# EAGLE design 50 pin 0.5mm FPC (EAGLE 6.4)
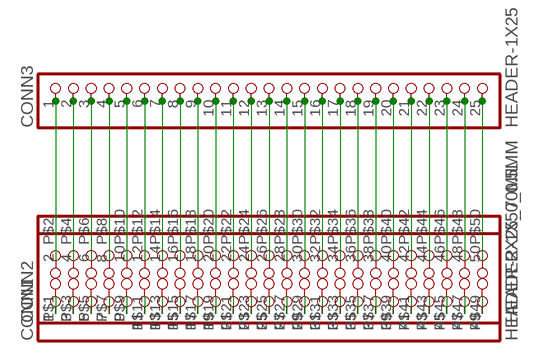
[diagram p0: schematic, sheet 1]

## Parts
CONN1  HEADER-2X25_70MIL  [2X25]
CONN2  HEADER-1X50_0.5MM  [FPC_GENERIC_0.5MM_50PIN]
CONN3  HEADER-1X25  [1X25_ROUND_70MIL]

## Nets
N$1: CONN1.1 CONN2.P$1
N$2: CONN1.2 CONN2.P$2 CONN3.1
N$3: CONN1.3 CONN2.P$3
N$4: CONN1.4 CONN2.P$4 CONN3.2
N$5: CONN1.5 CONN2.P$5
N$6: CONN1.6 CONN2.P$6 CONN3.3
N$7: CONN1.7 CONN2.P$7
N$8: CONN1.8 CONN2.P$8 CONN3.4
N$9: CONN1.9 CONN2.P$9
N$10: CONN1.10 CONN2.P$10 CONN3.5
N$11: CONN1.11 CONN2.P$11
N$12: CONN1.12 CONN2.P$12 CONN3.6
N$13: CONN1.13 CONN2.P$13
N$14: CONN1.14 CONN2.P$14 CONN3.7
N$15: CONN1.15 CONN2.P$15
N$16: CONN1.16 CONN2.P$16 CONN3.8
N$17: CONN1.17 CONN2.P$17
N$18: CONN1.18 CONN2.P$18 CONN3.9
N$19: CONN1.19 CONN2.P$19
N$20: CONN1.20 CONN2.P$20 CONN3.10
N$21: CONN1.21 CONN2.P$21
N$22: CONN1.22 CONN2.P$22 CONN3.11
N$23: CONN1.23 CONN2.P$23
N$24: CONN1.24 CONN2.P$24 CONN3.12
N$25: CONN1.25 CONN2.P$25
N$26: CONN1.26 CONN2.P$26 CONN3.13
N$27: CONN1.27 CONN2.P$27
N$28: CONN1.28 CONN2.P$28 CONN3.14
N$29: CONN1.29 CONN2.P$29
N$30: CONN1.30 CONN2.P$30 CONN3.15
N$31: CONN1.31 CONN2.P$31
N$32: CONN1.32 CONN2.P$32 CONN3.16
N$33: CONN1.33 CONN2.P$33
N$34: CONN1.34 CONN2.P$34 CONN3.17
N$35: CONN1.35 CONN2.P$35
N$36: CONN1.36 CONN2.P$36 CONN3.18
N$37: CONN1.37 CONN2.P$37
N$38: CONN1.38 CONN2.P$38 CONN3.19
N$39: CONN1.39 CONN2.P$39
N$40: CONN1.40 CONN2.P$40 CONN3.20
N$41: CONN1.41 CONN2.P$41
N$42: CONN1.42 CONN2.P$42 CONN3.21
N$43: CONN1.43 CONN2.P$43
N$44: CONN1.44 CONN2.P$44 CONN3.22
N$45: CONN1.45 CONN2.P$45
N$46: CONN1.46 CONN2.P$46 CONN3.23
N$47: CONN1.47 CONN2.P$47
N$48: CONN1.48 CONN2.P$48 CONN3.24
N$49: CONN1.49 CONN2.P$49
N$50: CONN1.50 CONN2.P$50 CONN3.25

## Library data of the parts
CONN1 = microbuilder:HEADER-2X25
CONN2 = microbuilder:HEADER-1X50
CONN3 = microbuilder:HEADER-1X25

## Board
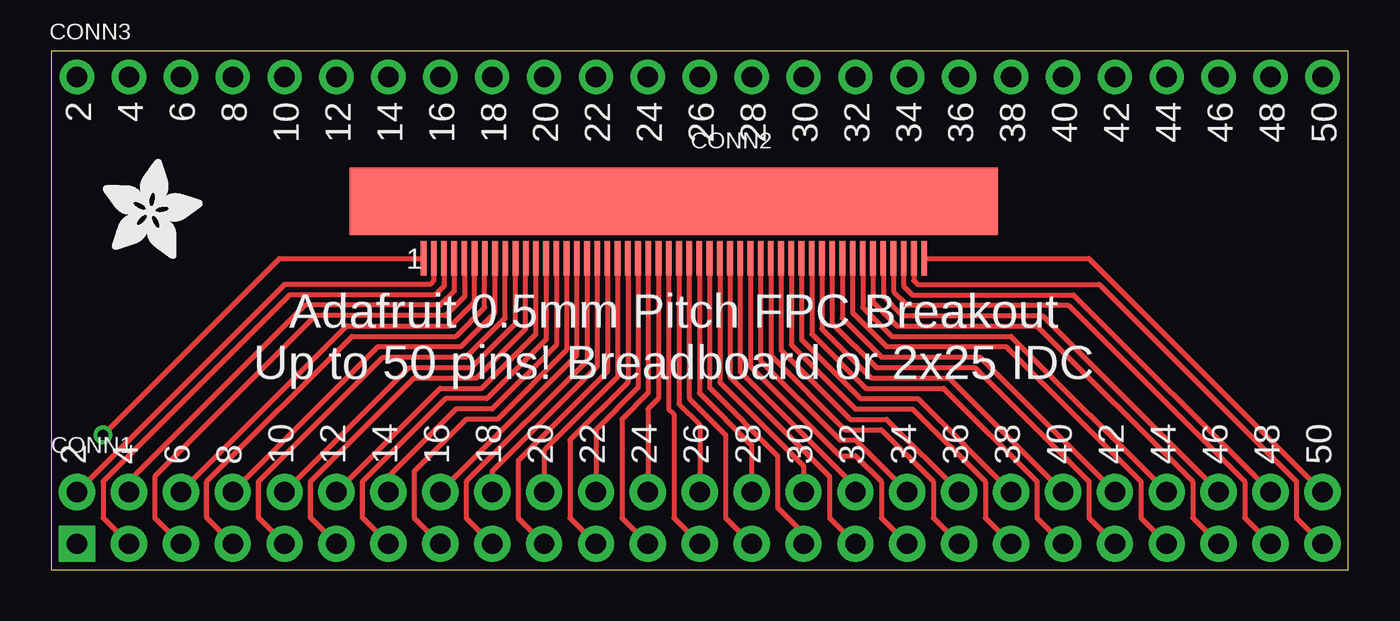
[diagram p1: board, top side]
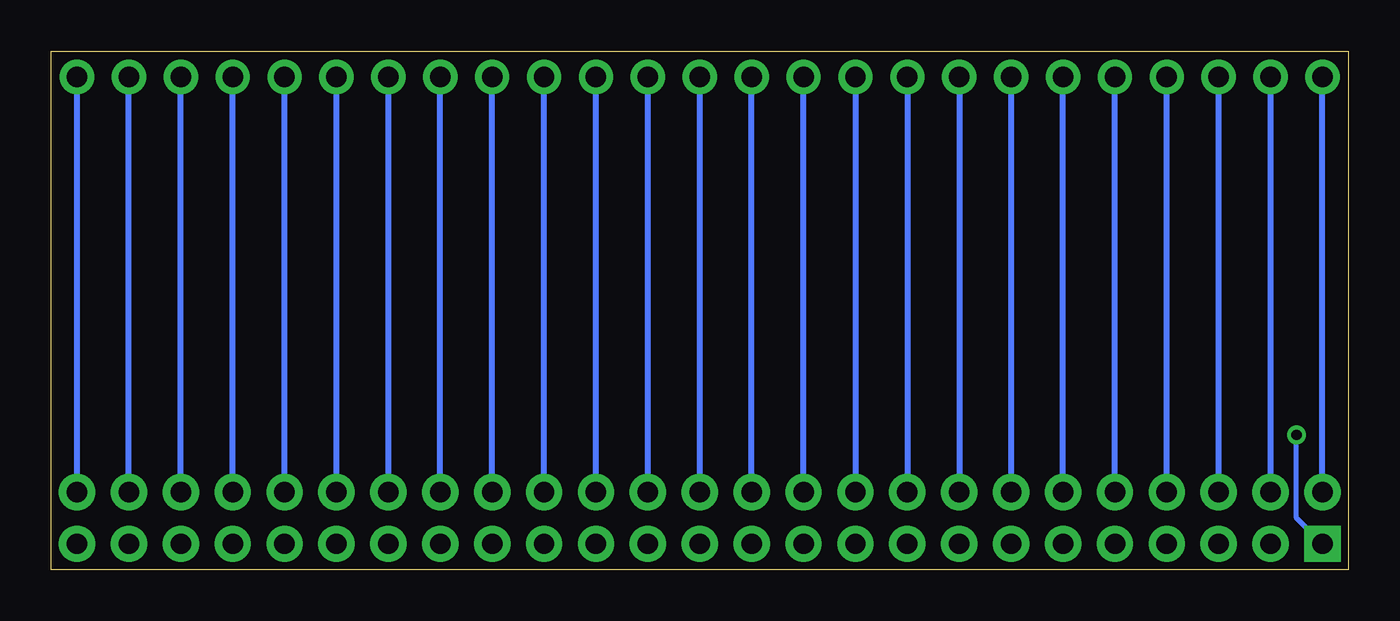
[diagram p2: board, bottom side, seen from below]

Size 63.5 x 25.4 mm. Coordinates in mm from the lower left corner, seen from the top.
Outline: 0,25.4 0,0 63.5,0 63.5,25.4 0,25.4
Copper layers (1*16): Top 0.035mm / dielectric 1.5mm / Bottom 0.035mm
Design rules "default": minimum track width 10mil, minimum drill 24mil, track to track 8mil, track to pad 8mil, pad to pad 8mil, via to via 8mil, smd to smd 8mil, copper to edge 40mil, drill to drill 8mil, minimum pad ring 10mil, minimum via ring 8mil, stop-mask expansion 4mil, vias tented up to drill 0mil, thermal gap 10mil

### Footprints (pad centres in the part's own frame; a part is rotated, then mirrored left to right if it is on the bottom)
2X25 = drill 1 pad 1.778 square: 1 -30.48,-1.27 | drill 1 pad 1.778: 2 -30.48,1.27; 3 -27.94,-1.27; 4 -27.94,1.27; 5 -25.4,-1.27; 6 -25.4,1.27; 7 -22.86,-1.27; 8 -22.86,1.27; 9 -20.32,-1.27; 10 -20.32,1.27; 11 -17.78,-1.27; 12 -17.78,1.27; 13 -15.24,-1.27; 14 -15.24,1.27; 15 -12.7,-1.27; 16 -12.7,1.27; 17 -10.16,-1.27; 18 -10.16,1.27; 19 -7.62,-1.27; 20 -7.62,1.27; 21 -5.08,-1.27; 22 -5.08,1.27; 23 -2.54,-1.27; 24 -2.54,1.27; 25 0,-1.27; 26 0,1.27; 27 2.54,-1.27; 28 2.54,1.27; 29 5.08,-1.27; 30 5.08,1.27; 31 7.62,-1.27; 32 7.62,1.27; 33 10.16,-1.27; 34 10.16,1.27; 35 12.7,-1.27; 36 12.7,1.27; 37 15.24,-1.27; 38 15.24,1.27; 39 17.78,-1.27; 40 17.78,1.27; 41 20.32,-1.27; 42 20.32,1.27; 43 22.86,-1.27; 44 22.86,1.27; 45 25.4,-1.27; 46 25.4,1.27; 47 27.94,-1.27; 48 27.94,1.27; 49 30.48,-1.27; 50 30.48,1.27
FPC_GENERIC_0.5MM_50PIN = smd 0.28 x 1.7: P$1 12.25,1.01; P$2 11.75,1.01; P$3 11.25,1.01; P$4 10.75,1.01; P$5 10.25,1.01; P$6 9.75,1.01; P$7 9.25,1.01; P$8 8.75,1.01; P$9 8.25,1.01; P$10 7.75,1.01; P$11 7.25,1.01; P$12 6.75,1.01; P$13 6.25,1.01; P$14 5.75,1.01; P$15 5.25,1.01; P$16 4.75,1.01; P$17 4.25,1.01; P$18 3.75,1.01; P$19 3.25,1.01; P$20 2.75,1.01; P$21 2.25,1.01; P$22 1.75,1.01; P$23 1.25,1.01; P$24 0.75,1.01; P$25 0.25,1.01; P$26 -0.25,1.01; P$27 -0.75,1.01; P$28 -1.25,1.01; P$29 -1.75,1.01; P$30 -2.25,1.01; P$31 -2.75,1.01; P$32 -3.25,1.01; P$33 -3.75,1.01; P$34 -4.25,1.01; P$35 -4.75,1.01; P$36 -5.25,1.01; P$37 -5.75,1.01; P$38 -6.25,1.01; P$39 -6.75,1.01; P$40 -7.25,1.01; P$41 -7.75,1.01; P$42 -8.25,1.01; P$43 -8.75,1.01; P$44 -9.25,1.01; P$45 -9.75,1.01; P$46 -10.25,1.01; P$47 -10.75,1.01; P$48 -11.25,1.01; P$49 -11.75,1.01; P$50 -12.25,1.01 | smd 31.75 x 3.3: SUPPORT 0,-1.79
1X25_ROUND_70MIL = drill 1 pad 1.676: 1 -30.48,0; 2 -27.94,0; 3 -25.4,0; 4 -22.86,0; 5 -20.32,0; 6 -17.78,0; 7 -15.24,0; 8 -12.7,0; 9 -10.16,0; 10 -7.62,0; 11 -5.08,0; 12 -2.54,0; 13 0,0; 14 2.54,0; 15 5.08,0; 16 7.62,0; 17 10.16,0; 18 12.7,0; 19 15.24,0; 20 17.78,0; 21 20.32,0; 22 22.86,0; 23 25.4,0; 24 27.94,0; 25 30.48,0

### Placement (x,y rotation side)
CONN1  31.75,2.54 0 top
CONN2  30.48,16.26 180 top
CONN3  31.75,24.13 0 top
U$1  [ADAFRUIT_5MM]  2.54,15.24 0 top

### Tracks (layer width: path | path; a pad name or v marks a point on that pad's centre or on a via)
N$1  (via drill 0.5)
  Top 0.254: v2.54,6.6 11.18,15.25 CONN2.P$1
  Bottom 0.254: CONN1.1 2.54,2.54 v2.54,6.6
N$2
  Top 0.254: CONN2.P$2 18.73,14.16 18.54,13.97 11.43,13.97 CONN1.2
  Bottom 0.305: CONN1.2 CONN3.1
N$3
  Top 0.254: CONN2.P$3 19.23,13.9 18.8,13.46 11.68,13.46 2.54,4.32 2.54,2.54 CONN1.3
N$4
  Top 0.254: CONN2.P$4 19.73,13.63 19.05,12.95 12.45,12.95 3.81,4.32 CONN1.4
  Bottom 0.305: CONN1.4 CONN3.2
N$5
  Top 0.254: CONN2.P$5 20.23,13.37 19.3,12.45 12.95,12.45 5.08,4.57 5.08,2.54 CONN1.5
N$6
  Top 0.254: CONN1.6 14.48,11.94 19.56,11.94 20.73,13.11 CONN2.P$6
  Bottom 0.305: CONN1.6 CONN3.3
N$7
  Top 0.254: CONN1.7 7.62,2.54 7.62,4.32 14.73,11.43 19.81,11.43 21.23,12.85 CONN2.P$7
N$8
  Top 0.254: CONN1.8 16,10.92 20.07,10.92 21.73,12.59 CONN2.P$8
  Bottom 0.305: CONN1.8 CONN3.4
N$9
  Top 0.254: CONN1.9 10.16,2.54 10.16,4.32 16.26,10.41 20.32,10.41 22.23,12.32 CONN2.P$9
N$10
  Top 0.254: CONN1.10 17.53,9.91 20.57,9.91 22.73,12.06 CONN2.P$10
  Bottom 0.305: CONN1.10 CONN3.5
N$11
  Top 0.254: CONN1.11 12.7,2.54 12.7,4.32 17.78,9.4 20.83,9.4 23.23,11.8 CONN2.P$11
N$12
  Top 0.254: CONN1.12 19.05,8.89 21.08,8.89 23.73,11.54 CONN2.P$12
  Bottom 0.305: CONN1.12 CONN3.6
N$13
  Top 0.254: CONN1.13 15.24,2.54 15.24,4.32 19.3,8.38 21.34,8.38 24.23,11.28 CONN2.P$13
N$14
  Top 0.254: CONN2.P$14 24.73,11.01 21.59,7.87 19.81,7.87 16.51,4.57 CONN1.14
  Bottom 0.305: CONN3.7 CONN1.14
N$15
  Top 0.254: CONN2.P$15 25.23,10.75 21.84,7.37 20.32,7.37 17.78,4.83 17.78,2.54 CONN1.15
N$16
  Top 0.254: CONN2.P$16 25.73,10.49 CONN1.16
  Bottom 0.305: CONN3.8 CONN1.16
N$17
  Top 0.254: CONN2.P$17 26.23,10.23 20.32,4.32 20.32,2.54 CONN1.17
N$18
  Top 0.254: CONN2.P$18 26.73,9.97 21.59,4.83 CONN1.18 21.59,3.3
  Bottom 0.305: CONN3.9 CONN1.18
N$19
  Top 0.254: CONN2.P$19 27.23,9.7 22.86,5.33 22.86,2.54 CONN1.19
N$20
  Top 0.254: CONN2.P$20 27.73,9.44 24.13,5.84 CONN1.20
  Bottom 0.305: CONN3.10 CONN1.20
N$21
  Top 0.254: CONN2.P$21 28.23,9.18 25.4,6.35 25.4,2.54 CONN1.21
N$22
  Top 0.254: CONN2.P$22 28.73,8.92 26.67,6.86 CONN1.22
  Bottom 0.305: CONN1.22 CONN3.11
N$23
  Top 0.254: CONN2.P$23 29.23,8.66 27.94,7.37 27.94,2.54 CONN1.23
N$24
  Top 0.254: CONN2.P$24 29.73,8.39 29.21,7.87 CONN1.24
  Bottom 0.305: CONN1.24 CONN3.12
N$25
  Top 0.254: CONN2.P$25 30.23,7.87 30.48,7.62 30.48,2.54 CONN1.25
N$26
  Top 0.254: CONN2.P$26 30.73,8.13 31.75,7.11 CONN1.26
  Bottom 0.305: CONN1.26 CONN3.13
N$27
  Top 0.254: CONN2.P$27 31.23,8.39 33.02,6.6 33.02,2.54 CONN1.27
N$28
  Top 0.254: CONN2.P$28 31.73,8.66 34.29,6.1 CONN1.28
  Bottom 0.305: CONN1.28 CONN3.14
N$29
  Top 0.254: CONN2.P$29 32.23,8.92 35.56,5.59 35.56,3.05 36.83,1.78 CONN1.29
N$30
  Top 0.254: CONN2.P$30 32.73,9.18 36.83,5.08 CONN1.30
  Bottom 0.305: CONN1.30 CONN3.15
N$31
  Top 0.254: CONN2.P$31 33.23,9.44 38.1,4.57 38.1,2.54 CONN1.31
N$32
  Top 0.254: CONN2.P$32 33.73,9.7 39.37,4.06 CONN1.32
  Bottom 0.305: CONN1.32 CONN3.16
N$33
  Top 0.254: CONN2.P$33 34.23,9.97 38.61,5.59 39.37,5.59 40.64,4.32 40.64,2.54 CONN1.33
N$34
  Top 0.254: CONN2.P$34 34.73,10.23 38.61,6.35 39.37,6.35 CONN1.34
  Bottom 0.305: CONN1.34 CONN3.17
N$35
  Top 0.254: CONN2.P$35 35.23,10.49 38.86,6.86 40.64,6.86 43.18,4.32 43.18,2.54 CONN1.35
N$36
  Top 0.254: CONN2.P$36 35.73,10.75 39.12,7.37 40.89,7.37 CONN1.36
  Bottom 0.305: CONN1.36 CONN3.18
N$37
  Top 0.254: CONN2.P$37 36.23,11.01 39.37,7.87 42.16,7.87 45.72,4.32 45.72,2.54 CONN1.37
N$38
  Top 0.254: CONN2.P$38 36.73,11.28 39.62,8.38 42.42,8.38 CONN1.38
  Bottom 0.305: CONN1.38 CONN3.19
N$39
  Top 0.254: CONN2.P$39 37.23,11.54 39.88,8.89 43.69,8.89 48.26,4.32 48.26,2.54 CONN1.39
N$40
  Top 0.254: CONN2.P$40 37.73,11.8 40.13,9.4 43.94,9.4 CONN1.40
  Bottom 0.305: CONN1.40 CONN3.20
N$41
  Top 0.254: CONN2.P$41 38.23,12.06 40.39,9.91 45.21,9.91 50.8,4.32 50.8,2.54 CONN1.41
N$42
  Top 0.254: CONN2.P$42 38.73,12.32 40.64,10.41 45.47,10.41 CONN1.42
  Bottom 0.305: CONN1.42 CONN3.21
N$43
  Top 0.254: CONN2.P$43 39.23,12.59 40.89,10.92 46.74,10.92 53.34,4.32 53.34,2.54 CONN1.43
N$44
  Top 0.254: CONN2.P$44 39.73,12.85 41.15,11.43 46.99,11.43 CONN1.44
  Bottom 0.305: CONN1.44 CONN3.22
N$45
  Top 0.254: CONN2.P$45 40.23,13.11 41.4,11.94 48.26,11.94 55.88,4.32 55.88,2.54 CONN1.45
N$46
  Top 0.254: CONN2.P$46 40.73,13.37 41.66,12.45 48.51,12.45 CONN1.46
  Bottom 0.305: CONN1.46 CONN3.23
N$47
  Top 0.254: CONN2.P$47 41.23,13.63 41.91,12.95 49.78,12.95 58.42,4.32 58.42,2.54 CONN1.47
N$48
  Top 0.254: CONN2.P$48 41.73,13.9 42.16,13.46 50.04,13.46 CONN1.48
  Bottom 0.305: CONN1.48 CONN3.24
N$49
  Top 0.254: CONN2.P$49 42.23,14.16 42.42,13.97 51.31,13.97 60.96,4.32 60.96,2.54 CONN1.49
N$50
  Top 0.254: CONN2.P$50 50.79,15.25 CONN1.50
  Bottom 0.305: CONN1.50 CONN3.25

### Text on the board
tPlace: 2 | 4 | 6 | 8 | 10 | 12 | 14 | 16 | 18 | 20 | 22 | 24 | 26 | 28 | 30 | 32 | 34 | 36 | 38 | 40 | 42 | 44 | 46 | 48 | 50 | 1 | Adafruit 0.5mm Pitch FPC Breakout / Up to 50 pins! Breadboard or 2x25 IDC | 2 | 4 | 6 | 8 | 10 | 12 | 14 | 16 | 18 | 20 | 22 | 24 | 26 | 28 | 30 | 32 | 34 | 36 | 38 | 40 | 42 | 44 | 46 | 48 | 50